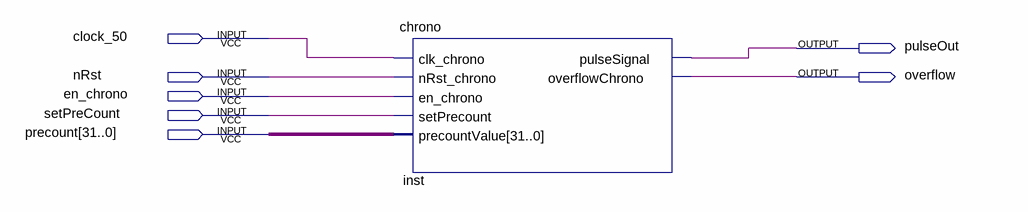
[diagram p0: schematic sheet]
// Quartus schematic chronotest.bdf as structural Verilog: 1 symbols, 7 pins
module chronotest (
  input  clock_50,
  input  nRst,
  input  en_chrono,
  input  setPreCount,
  input  [31:0] precount,
  output pulseOut,
  output overflow
);

  chrono inst (
    .clk_chrono(clock_50), .nRst_chrono(nRst), .en_chrono(en_chrono), .setPrecount(setPreCount),
    .precountValue(precount), .pulseSignal(pulseOut), .overflowChrono(overflow));
endmodule
